# EAGLE schematic SP2 (EAGLE 9.4.2)
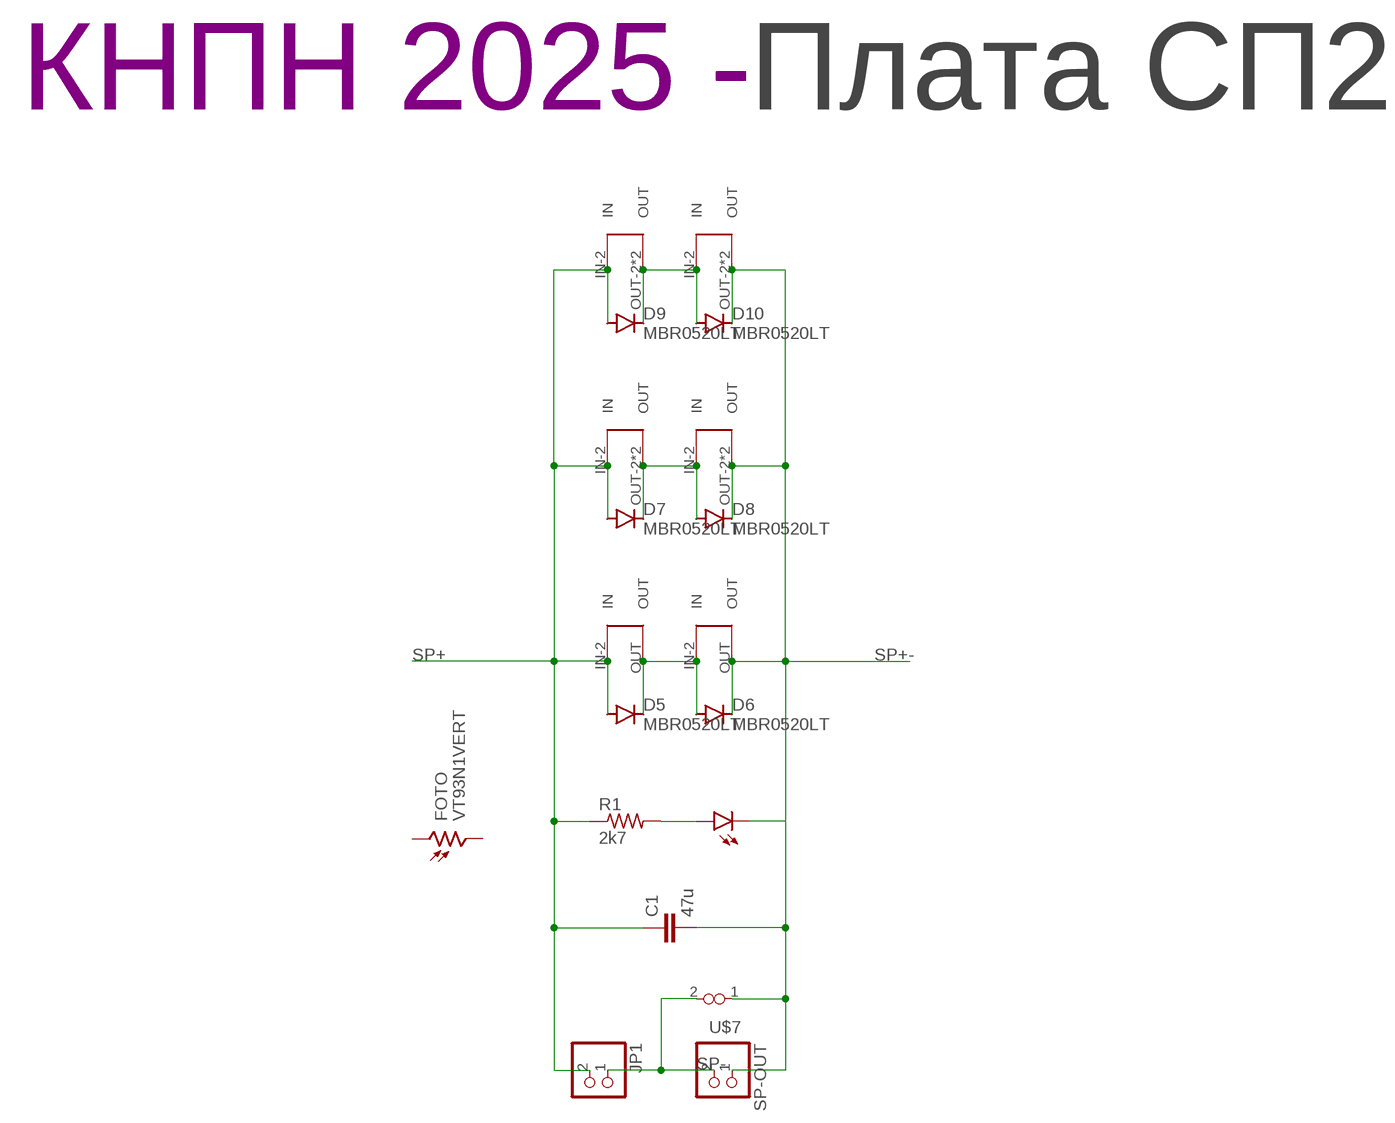
[diagram p0: schematic, sheet 1]

## Parts
C1  47u  C-EUC1210  [C1210]
D5  MBR0520LT  [SOD123]
D6  MBR0520LT  [SOD123]
D7  MBR0520LT  [SOD123]
D8  MBR0520LT  [SOD123]
D9  MBR0520LT  [SOD123]
D10  MBR0520LT  [SOD123]
FOTO  VT93N1VERT  [VT93N1-VERT]
JP1  PINHD-1X2  [1X02]
PWR  LEDCHIP-LED0603  [CHIP-LED0603]
R1  2k7  R-US_R0603  [R0603]
SP-OUT  PINHD-1X2  [1X02]
U$1  Плата СП2  LOGOPCB-""  [LOGO]
U$5  SOLAR-2_1  [SOLAR_1-2]
U$6  SOLAR-2_1  [SOLAR_1-2]
U$7  VIAS-CONNECT  [VIAS-CONNECT]
U$8  SOLAR-2_0  [SOLAR_0-2]
U$9  SOLAR-2_0  [SOLAR_0-2]
U$10  SOLAR-2_0  [SOLAR_0-2]
U$11  SOLAR-2_0  [SOLAR_0-2]

## Nets
N$4: PWR.A R1.2
N$5: D5.C D6.A U$5.OUT U$6.IN-2(IN)
N$7: D7.C D8.A U$8.OUT-2(OUT) U$8.OUT-21(OUT) U$9.IN-2(IN)
N$8: D9.C D10.A U$10.OUT-2(OUT) U$10.OUT-21(OUT) U$11.IN-2(IN)
SP+: C1.1 D5.A D7.A D9.A JP1.2 R1.1 U$5.IN-2(IN) U$8.IN-2(IN) U$10.IN-2(IN)
SP+-: C1.2 D6.C D8.C D10.C PWR.C SP-OUT.1 U$6.OUT U$7.1 U$9.OUT-2(OUT) U$9.OUT-21(OUT) U$11.OUT-2(OUT) U$11.OUT-21(OUT)
SP-: JP1.1 SP-OUT.2 U$7.2
Unconnected: FOTO.P$1 FOTO.P$2

## Library data of the parts
C1 = rcl:C-EU: CAPACITOR, European symbol; SPICEPREFIX: C
D5-D10 = diode:MBR0520LT: SCHOTTKY BARRIER RECTIFIER Source: http://onsemi.com .. MBR0520LT1-D.pdf
FOTO = KNPN-2023:VT93N1
JP1 SP-OUT = pinhead:PINHD-1X2: PIN HEADER
PWR = led:LED: LED OSRAM: - CHIPLED LG R971, LG N971, LY N971, LG Q971, LY Q971, LO R971, LY R971 LH N974, LH R974 LS Q976, LO Q976, LY Q976 LO Q996 - Hyper CHIPLED LW Q18S LB Q993, LB Q99A, LB R99A - SideLED LS A670, LO A670, LY A670, LG A670, LP A670 LB A673, LV A673, LT A673, LW A673 LH A674 LY A675 LS A676, LA A676, LO A676, LY A676, LW A676 LS A679, LY A679, LG A679 - Hyper Micro SIDELED® LS Y876, LA Y876, LO Y876, LY Y876 LT Y87S - SmartLED LW L88C, LW L88S LB L89C, LB L89S, LG L890 LS L89K, LO L89K, LY L89K LS L896, LA L896, LO L896, LY L896 - TOPLED LS T670, LO T670, LY T670, LG T670, LP T670 LSG T670, LSP T670, LSY T670, LOP T670, LYG T670 LG T671, LOG T671, LSG T671 LB T673, LV T673, LT T673, LW T673 LH T674 LS T676, LA T676, LO T676, LY T676, LB T676, LH T676, LSB T676, LW T676 LB T67C, LV T67C, LT T67C, LS T67K, LO T67K, LY T67K, LW E67C LS E67B, LA E67B, LO E67B, LY E67B, LB E67C, LV E67C, LT E67C LW T67C LS T679, LY T679, LG T679 LS T770, LO T770, LY T770, LG T770, LP T770 LB T773, LV T773, LT T773, LW T773 LH T774 LS E675, LA E675, LY E675, LS T675 LS T776, LA T776, LO T776, LY T776, LB T776 LHGB T686 LT T68C, LB T68C - Hyper Mini TOPLED® LB M676 - Mini TOPLED Santana® LG M470 LS M47K, LO M47K, LY M47K Source: http://www.osram.convergy.de LUXEON: - LUMILED® LXK2-PW12-R00, LXK2-PW12-S00, LXK2-PW14-U00, LXK2-PW14-V00 LXK2-PM12-R00, LXK2-PM12-S00, LXK2-PM14-U00 LXK2-PE12-Q00, LXK2-PE12-R00, LXK2-PE12-S00, LXK2-PE14-T00, LXK2-PE14-U00 LXK2-PB12-K00, LXK2-PB12-L00, LXK2-PB12-M00, LXK2-PB14-N00, LXK2-PB14-P00, LXK2-PB14-Q00 LXK2-PR12-L00, LXK2-PR12-M00, LXK2-PR14-Q00, LXK2-PR14-R00 LXK2-PD12-Q00, LXK2-PD12-R00, LXK2-PD12-S00 LXK2-PH12-R00, LXK2-PH12-S00 LXK2-PL12-P00, LXK2-PL12-Q00, LXK2-PL12-R00 Source: www.luxeon.com KINGBRIGHT: KA-3528ASYC Source: www.kingbright.com
R1 = rcl:R-US_: RESISTOR, American symbol; SPICEPREFIX: R
U$1 = UNKNOWN-2024:LOGO
U$5 U$6 U$8-U$11 = CanCubeSat:SOLAR-2
U$7 = KNPN-2023:VIAS-CONNECT